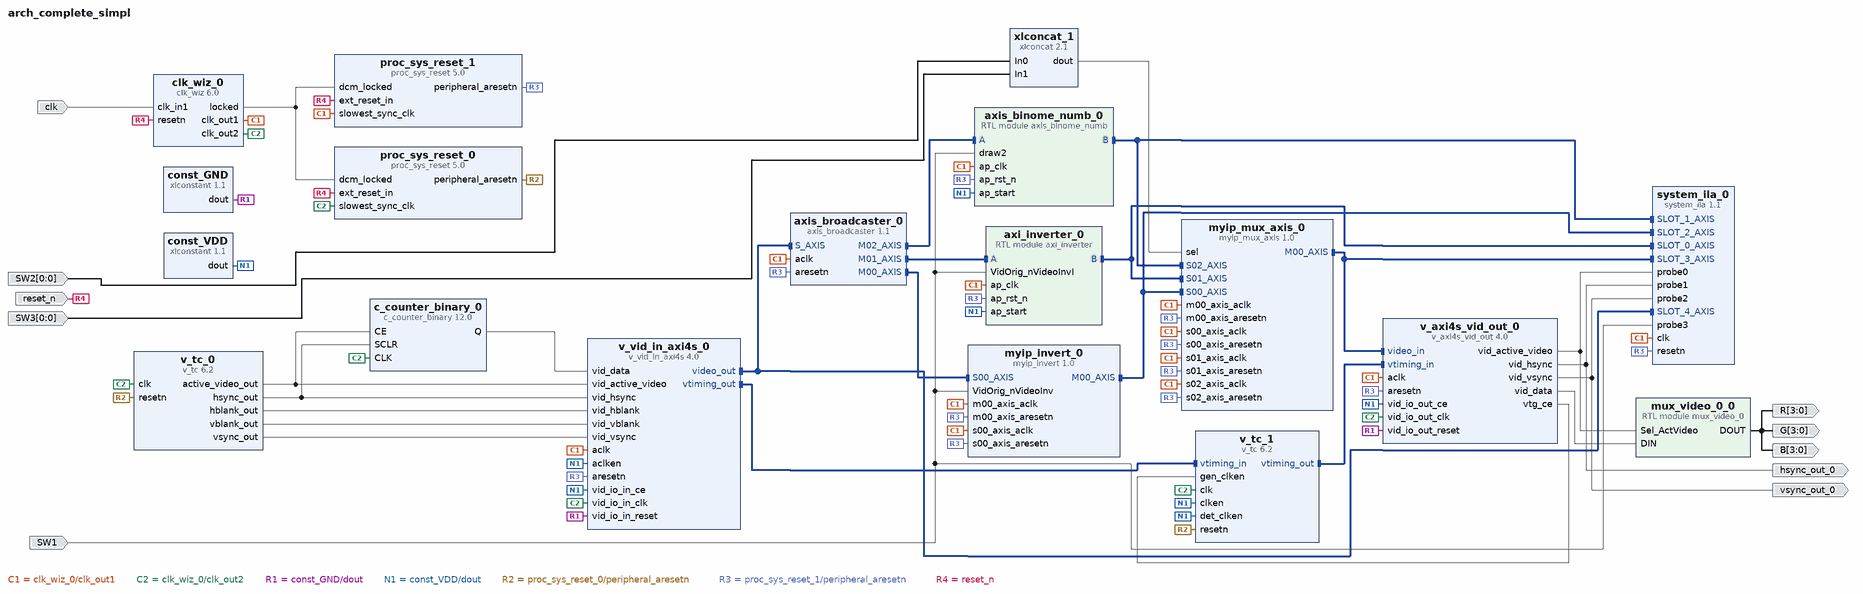
[diagram p0: block diagram of the top level]
# Vivado block design arch_complete_simpl, xc7z020clg484-1, Vivado 2019.2
create_bd_design arch_complete_simpl

create_bd_port -dir O -from 3 -to 0 B
create_bd_port -dir O -from 3 -to 0 G
create_bd_port -dir O -from 3 -to 0 R
create_bd_port -dir I SW1
create_bd_port -dir I -from 0 -to 0 SW2
create_bd_port -dir I -from 0 -to 0 SW3
create_bd_port -dir I -type clk clk
create_bd_port -dir O hsync_out_0
create_bd_port -dir I -type rst reset_n
create_bd_port -dir O vsync_out_0

create_bd_cell -type module -reference axis_binome_numb axis_binome_numb_0
create_bd_cell -type ip -vlnv xilinx.com:ip:axis_broadcaster:1.1 axis_broadcaster_0
set_property -dict {CONFIG.M02_TDATA_REMAP {tdata[7:0]} CONFIG.NUM_MI 3} [get_bd_cells axis_broadcaster_0]
create_bd_cell -type ip -vlnv xilinx.com:ip:c_counter_binary:12.0 c_counter_binary_0
set_property -dict {CONFIG.CE true CONFIG.Output_Width 8 CONFIG.SCLR true} [get_bd_cells c_counter_binary_0]
create_bd_cell -type ip -vlnv xilinx.com:ip:clk_wiz:6.0 clk_wiz_0
set_property -dict [list \
  CONFIG.CLKOUT1_JITTER 114.767 \
  CONFIG.CLKOUT1_PHASE_ERROR 87.466 \
  CONFIG.CLKOUT1_REQUESTED_OUT_FREQ 108.000 \
  CONFIG.CLKOUT2_JITTER 155.403 \
  CONFIG.CLKOUT2_PHASE_ERROR 87.466 \
  CONFIG.CLKOUT2_REQUESTED_OUT_FREQ 25.2 \
  CONFIG.CLKOUT2_USED true \
  CONFIG.MMCM_CLKFBOUT_MULT_F 11.875 \
  CONFIG.MMCM_CLKOUT0_DIVIDE_F 11.000 \
  CONFIG.MMCM_CLKOUT1_DIVIDE 47 \
  CONFIG.MMCM_DIVCLK_DIVIDE 1 \
  CONFIG.NUM_OUT_CLKS 2 \
  CONFIG.RESET_PORT resetn \
  CONFIG.RESET_TYPE ACTIVE_LOW \
] [get_bd_cells clk_wiz_0]
create_bd_cell -type ip -vlnv xilinx.com:ip:xlconstant:1.1 const_GND
set_property -dict {CONFIG.CONST_VAL 0} [get_bd_cells const_GND]
create_bd_cell -type ip -vlnv xilinx.com:ip:xlconstant:1.1 const_VDD
create_bd_cell -type module -reference mux_video_0 mux_video_0_0
create_bd_cell -type ip -vlnv xilinx.com:user:myip_invert:1.0 myip_invert_0
set_property -dict {CONFIG.C_M00_AXIS_START_COUNT 32} [get_bd_cells myip_invert_0]
create_bd_cell -type ip -vlnv xilinx.com:user:myip_mux_axis:1.0 myip_mux_axis_0
create_bd_cell -type ip -vlnv xilinx.com:ip:proc_sys_reset:5.0 proc_sys_reset_0
create_bd_cell -type ip -vlnv xilinx.com:ip:proc_sys_reset:5.0 proc_sys_reset_1
create_bd_cell -type ip -vlnv xilinx.com:ip:system_ila:1.1 system_ila_0
set_property -dict [list \
  CONFIG.C_MON_TYPE MIX \
  CONFIG.C_NUM_MONITOR_SLOTS 5 \
  CONFIG.C_NUM_OF_PROBES 4 \
  CONFIG.C_PROBE0_TYPE 0 \
  CONFIG.C_PROBE1_TYPE 0 \
  CONFIG.C_PROBE2_TYPE 0 \
  CONFIG.C_PROBE3_TYPE 0 \
  CONFIG.C_SLOT_0_APC_EN 0 \
  CONFIG.C_SLOT_0_AXI_DATA_SEL 1 \
  CONFIG.C_SLOT_0_AXI_TRIG_SEL 1 \
  CONFIG.C_SLOT_0_INTF_TYPE xilinx.com:interface:axis_rtl:1.0 \
  CONFIG.C_SLOT_1_APC_EN 0 \
  CONFIG.C_SLOT_1_AXI_DATA_SEL 1 \
  CONFIG.C_SLOT_1_AXI_TRIG_SEL 1 \
  CONFIG.C_SLOT_1_INTF_TYPE xilinx.com:interface:axis_rtl:1.0 \
  CONFIG.C_SLOT_2_APC_EN 0 \
  CONFIG.C_SLOT_2_AXI_DATA_SEL 1 \
  CONFIG.C_SLOT_2_AXI_TRIG_SEL 1 \
  CONFIG.C_SLOT_2_INTF_TYPE xilinx.com:interface:axis_rtl:1.0 \
  CONFIG.C_SLOT_3_APC_EN 0 \
  CONFIG.C_SLOT_3_AXI_DATA_SEL 1 \
  CONFIG.C_SLOT_3_AXI_TRIG_SEL 1 \
  CONFIG.C_SLOT_3_INTF_TYPE xilinx.com:interface:axis_rtl:1.0 \
  CONFIG.C_SLOT_4_APC_EN 0 \
  CONFIG.C_SLOT_4_AXI_DATA_SEL 1 \
  CONFIG.C_SLOT_4_AXI_TRIG_SEL 1 \
  CONFIG.C_SLOT_4_INTF_TYPE xilinx.com:interface:axis_rtl:1.0 \
] [get_bd_cells system_ila_0]
create_bd_cell -type ip -vlnv xilinx.com:ip:v_axi4s_vid_out:4.0 v_axi4s_vid_out_0
set_property -dict [list \
  CONFIG.C_ADDR_WIDTH 11 \
  CONFIG.C_HAS_ASYNC_CLK 1 \
  CONFIG.C_S_AXIS_VIDEO_FORMAT 12 \
] [get_bd_cells v_axi4s_vid_out_0]
create_bd_cell -type ip -vlnv xilinx.com:ip:v_tc:6.2 v_tc_0
set_property -dict {CONFIG.HAS_AXI4_LITE false CONFIG.VIDEO_MODE 480p CONFIG.enable_detection false} [get_bd_cells v_tc_0]
create_bd_cell -type ip -vlnv xilinx.com:ip:v_tc:6.2 v_tc_1
set_property -dict {CONFIG.HAS_AXI4_LITE false CONFIG.VIDEO_MODE 480p CONFIG.auto_generation_mode true} [get_bd_cells v_tc_1]
create_bd_cell -type ip -vlnv xilinx.com:ip:v_vid_in_axi4s:4.0 v_vid_in_axi4s_0
set_property -dict {CONFIG.C_HAS_ASYNC_CLK 1 CONFIG.C_M_AXIS_VIDEO_FORMAT 12} [get_bd_cells v_vid_in_axi4s_0]
create_bd_cell -type ip -vlnv xilinx.com:ip:xlconcat:2.1 xlconcat_1
set_property -dict {CONFIG.IN0_WIDTH 1 CONFIG.IN1_WIDTH 1} [get_bd_cells xlconcat_1]
create_bd_cell -type module -reference axi_inverter axi_inverter_0

# ---- connections ----

connect_bd_intf_net [get_bd_intf_pins myip_mux_axis_0/S02_AXIS] [get_bd_intf_pins axis_binome_numb_0/B]
connect_bd_intf_net [get_bd_intf_pins myip_mux_axis_0/S02_AXIS] [get_bd_intf_pins system_ila_0/SLOT_1_AXIS]
connect_bd_intf_net [get_bd_intf_pins myip_mux_axis_0/S00_AXIS] [get_bd_intf_pins myip_invert_0/M00_AXIS]
connect_bd_intf_net [get_bd_intf_pins myip_mux_axis_0/S00_AXIS] [get_bd_intf_pins system_ila_0/SLOT_2_AXIS]
connect_bd_intf_net [get_bd_intf_pins axis_broadcaster_0/M01_AXIS] [get_bd_intf_pins axi_inverter_0/A]
connect_bd_intf_net [get_bd_intf_pins v_vid_in_axi4s_0/video_out] [get_bd_intf_pins axis_broadcaster_0/S_AXIS]
connect_bd_intf_net [get_bd_intf_pins v_vid_in_axi4s_0/video_out] [get_bd_intf_pins system_ila_0/SLOT_4_AXIS]
connect_bd_intf_net [get_bd_intf_pins v_vid_in_axi4s_0/vtiming_out] [get_bd_intf_pins v_tc_1/vtiming_in]
connect_bd_intf_net [get_bd_intf_pins myip_mux_axis_0/M00_AXIS] [get_bd_intf_pins v_axi4s_vid_out_0/video_in]
connect_bd_intf_net [get_bd_intf_pins myip_mux_axis_0/M00_AXIS] [get_bd_intf_pins system_ila_0/SLOT_3_AXIS]
connect_bd_intf_net [get_bd_intf_pins myip_mux_axis_0/S01_AXIS] [get_bd_intf_pins axi_inverter_0/B]
connect_bd_intf_net [get_bd_intf_pins myip_mux_axis_0/S01_AXIS] [get_bd_intf_pins system_ila_0/SLOT_0_AXIS]
connect_bd_intf_net [get_bd_intf_pins axis_broadcaster_0/M02_AXIS] [get_bd_intf_pins axis_binome_numb_0/A]
connect_bd_intf_net [get_bd_intf_pins axis_broadcaster_0/M00_AXIS] [get_bd_intf_pins myip_invert_0/S00_AXIS]
connect_bd_intf_net [get_bd_intf_pins v_tc_1/vtiming_out] [get_bd_intf_pins v_axi4s_vid_out_0/vtiming_in]
connect_bd_net -net In0_0_1 [get_bd_ports SW2] [get_bd_pins xlconcat_1/In0]
connect_bd_net -net In1_0_1 [get_bd_ports SW3] [get_bd_pins xlconcat_1/In1]
connect_bd_net -net VidOrig_nVideoInv_0_1 [get_bd_ports SW1] \
  [get_bd_pins myip_invert_0/VidOrig_nVideoInv] [get_bd_pins axis_binome_numb_0/draw2] [get_bd_pins system_ila_0/probe3] \
  [get_bd_pins axi_inverter_0/VidOrig_nVideoInvI]
connect_bd_net -net bit_extraction_0_DOUT [get_bd_pins mux_video_0_0/DOUT] [get_bd_ports R] [get_bd_ports G] [get_bd_ports B]
connect_bd_net [get_bd_pins c_counter_binary_0/Q] [get_bd_pins v_vid_in_axi4s_0/vid_data]
connect_bd_net -net clk_in1_0_1 [get_bd_ports clk] [get_bd_pins clk_wiz_0/clk_in1]
connect_bd_net [get_bd_pins clk_wiz_0/clk_out1] \
  [get_bd_pins proc_sys_reset_1/slowest_sync_clk] [get_bd_pins v_vid_in_axi4s_0/aclk] [get_bd_pins v_axi4s_vid_out_0/aclk] \
  [get_bd_pins myip_invert_0/s00_axis_aclk] [get_bd_pins myip_invert_0/m00_axis_aclk] [get_bd_pins axis_broadcaster_0/aclk] \
  [get_bd_pins myip_mux_axis_0/s00_axis_aclk] [get_bd_pins myip_mux_axis_0/s01_axis_aclk] \
  [get_bd_pins myip_mux_axis_0/s02_axis_aclk] [get_bd_pins myip_mux_axis_0/m00_axis_aclk] \
  [get_bd_pins axis_binome_numb_0/ap_clk] [get_bd_pins system_ila_0/clk] [get_bd_pins axi_inverter_0/ap_clk]
connect_bd_net [get_bd_pins clk_wiz_0/clk_out2] \
  [get_bd_pins c_counter_binary_0/CLK] [get_bd_pins proc_sys_reset_0/slowest_sync_clk] [get_bd_pins v_tc_0/clk] \
  [get_bd_pins v_vid_in_axi4s_0/vid_io_in_clk] [get_bd_pins v_tc_1/clk] [get_bd_pins v_axi4s_vid_out_0/vid_io_out_clk]
connect_bd_net [get_bd_pins clk_wiz_0/locked] [get_bd_pins proc_sys_reset_0/dcm_locked] [get_bd_pins proc_sys_reset_1/dcm_locked]
connect_bd_net [get_bd_pins const_GND/dout] [get_bd_pins v_vid_in_axi4s_0/vid_io_in_reset] [get_bd_pins v_axi4s_vid_out_0/vid_io_out_reset]
connect_bd_net [get_bd_pins const_VDD/dout] \
  [get_bd_pins v_vid_in_axi4s_0/vid_io_in_ce] [get_bd_pins v_vid_in_axi4s_0/aclken] [get_bd_pins v_tc_1/clken] \
  [get_bd_pins v_tc_1/det_clken] [get_bd_pins v_axi4s_vid_out_0/vid_io_out_ce] [get_bd_pins axis_binome_numb_0/ap_start] \
  [get_bd_pins axi_inverter_0/ap_start]
connect_bd_net [get_bd_pins proc_sys_reset_0/peripheral_aresetn] [get_bd_pins v_tc_0/resetn] [get_bd_pins v_tc_1/resetn]
connect_bd_net [get_bd_pins proc_sys_reset_1/peripheral_aresetn] \
  [get_bd_pins v_vid_in_axi4s_0/aresetn] [get_bd_pins v_axi4s_vid_out_0/aresetn] [get_bd_pins myip_invert_0/s00_axis_aresetn] \
  [get_bd_pins myip_invert_0/m00_axis_aresetn] [get_bd_pins axis_broadcaster_0/aresetn] \
  [get_bd_pins myip_mux_axis_0/s00_axis_aresetn] [get_bd_pins myip_mux_axis_0/s01_axis_aresetn] \
  [get_bd_pins myip_mux_axis_0/s02_axis_aresetn] [get_bd_pins myip_mux_axis_0/m00_axis_aresetn] \
  [get_bd_pins axis_binome_numb_0/ap_rst_n] [get_bd_pins system_ila_0/resetn] [get_bd_pins axi_inverter_0/ap_rst_n]
connect_bd_net -net resetn_0_1 [get_bd_ports reset_n] \
  [get_bd_pins clk_wiz_0/resetn] [get_bd_pins proc_sys_reset_0/ext_reset_in] [get_bd_pins proc_sys_reset_1/ext_reset_in]
connect_bd_net [get_bd_pins v_axi4s_vid_out_0/vid_active_video] [get_bd_pins mux_video_0_0/Sel_ActVideo] [get_bd_pins system_ila_0/probe0]
connect_bd_net [get_bd_pins v_axi4s_vid_out_0/vid_data] [get_bd_pins mux_video_0_0/DIN]
connect_bd_net [get_bd_pins v_axi4s_vid_out_0/vid_hsync] [get_bd_ports hsync_out_0] [get_bd_pins system_ila_0/probe1]
connect_bd_net [get_bd_pins v_axi4s_vid_out_0/vid_vsync] [get_bd_ports vsync_out_0] [get_bd_pins system_ila_0/probe2]
connect_bd_net [get_bd_pins v_axi4s_vid_out_0/vtg_ce] [get_bd_pins v_tc_1/gen_clken]
connect_bd_net [get_bd_pins v_tc_0/active_video_out] [get_bd_pins c_counter_binary_0/CE] [get_bd_pins v_vid_in_axi4s_0/vid_active_video]
connect_bd_net [get_bd_pins v_tc_0/hblank_out] [get_bd_pins v_vid_in_axi4s_0/vid_hblank]
connect_bd_net [get_bd_pins v_tc_0/hsync_out] [get_bd_pins c_counter_binary_0/SCLR] [get_bd_pins v_vid_in_axi4s_0/vid_hsync]
connect_bd_net [get_bd_pins v_tc_0/vblank_out] [get_bd_pins v_vid_in_axi4s_0/vid_vblank]
connect_bd_net [get_bd_pins v_tc_0/vsync_out] [get_bd_pins v_vid_in_axi4s_0/vid_vsync]
connect_bd_net [get_bd_pins xlconcat_1/dout] [get_bd_pins myip_mux_axis_0/sel]

validate_bd_design
save_bd_design
